# EAGLE design teste (EAGLE 7.6.0)
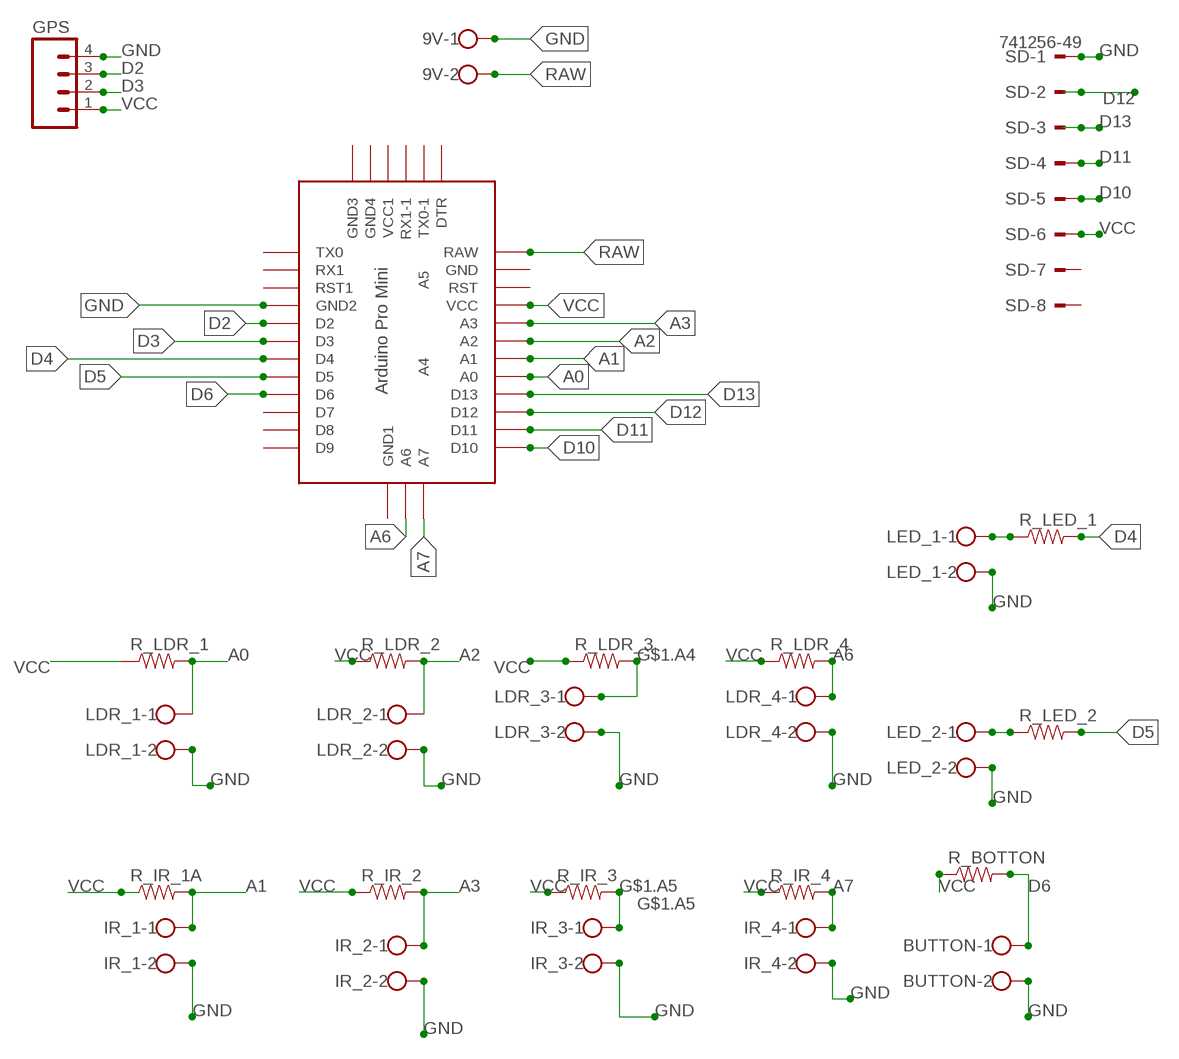
[diagram p0: schematic, sheet 1]

## Parts
9V  W237-102  [W237-102]
BUTTON  W237-102  [W237-102]
GPS  M04LONGPADS  [1X04_LONGPADS]
IR_1  W237-102  [W237-102]
IR_2  W237-102  [W237-102]
IR_3  W237-102  [W237-102]
IR_4  W237-102  [W237-102]
LDR_1  W237-102  [W237-102]
LDR_2  W237-102  [W237-102]
LDR_3  W237-102  [W237-102]
LDR_4  W237-102  [W237-102]
LED_1  W237-102  [W237-102]
LED_2  W237-102  [W237-102]
R_BOTTON  RESISTORAXIAL-0.3  [AXIAL-0.3]
R_IR_1A  RESISTORAXIAL-0.3  [AXIAL-0.3]
R_IR_2  RESISTORAXIAL-0.3  [AXIAL-0.3]
R_IR_3  RESISTORAXIAL-0.3  [AXIAL-0.3]
R_IR_4  RESISTORAXIAL-0.3  [AXIAL-0.3]
R_LDR_1  RESISTORAXIAL-0.3  [AXIAL-0.3]
R_LDR_2  RESISTORAXIAL-0.3  [AXIAL-0.3]
R_LDR_3  RESISTORAXIAL-0.3  [AXIAL-0.3]
R_LDR_4  RESISTORAXIAL-0.3  [AXIAL-0.3]
R_LED_1  RESISTORAXIAL-0.3  [AXIAL-0.3]
R_LED_2  RESISTORAXIAL-0.3  [AXIAL-0.3]
SD  741256-49  [741256-49]
U$2  ABK-PRO-MINI  [ABK-PRO-MINI]

## Nets
A0: LDR_1.1 R_LDR_1.P$2 U$2.A0
A1: IR_1.1 R_IR_1A.P$2 U$2.A1
A2: LDR_2.1 R_LDR_2.P$2 U$2.A2
A3: IR_2.1 R_IR_2.P$2 U$2.A3
A6: LDR_4.1 R_LDR_4.P$2 U$2.A6
A7: IR_4.1 R_IR_4.P$2 U$2.A7
D2: GPS.3 U$2.D2
D3: GPS.2 U$2.D3
D4: R_LED_1.P$2 U$2.D4
D5: R_LED_2.P$2 U$2.D5
D6: BUTTON.1 R_BOTTON.P$2 U$2.D6
D10: SD.5 U$2.D10
D11: SD.4 U$2.D11
D12: SD.2 U$2.D12
D13: SD.3 U$2.D13
G$1.A4: LDR_3.1 R_LDR_3.P$2
G$1.A5: IR_3.1 R_IR_3.P$2
GND: 9V.1 BUTTON.2 GPS.4 IR_1.2 IR_2.2 IR_3.2 IR_4.2 LDR_1.2 LDR_2.2 LDR_3.2 LDR_4.2 LED_1.2 LED_2.2 SD.1 U$2.GND1(GND2)
N$5: LED_1.1 R_LED_1.P$1
N$14: LED_2.1 R_LED_2.P$1
RAW: 9V.2 U$2.RAW
VCC: GPS.1 R_BOTTON.P$1 R_IR_1A.P$1 R_IR_2.P$1 R_IR_3.P$1 R_IR_4.P$1 R_LDR_1.P$1 R_LDR_2.P$1 R_LDR_3.P$1 R_LDR_4.P$1 SD.6 U$2.VCC
Unconnected: SD.7 SD.8 U$2.A4 U$2.A5 U$2.D7 U$2.D8 U$2.D9 U$2.DTR U$2.GND U$2.GND2(GND3) U$2.GND3(GND4) U$2.GND4(GND1) U$2.RST U$2.RST1 U$2.RX1 U$2.RX1-1 U$2.TX0 U$2.TX0-1 U$2.VCC1

## Library data of the parts
9V BUTTON IR_1-IR_4 LDR_1-LDR_4 LED_1 LED_2 = con-wago-500:W237-102: WAGO SCREW CLAMP; MPN: 237-102; OC_FARNELL: unknown; OC_NEWARK: 70K9898
GPS = SparkFun-Connectors:M04: Header 4 Standard 4-pin 0.1" header. Use with straight break away headers (SKU : PRT-00116), right angle break away headers (PRT-00553), swiss pins (PRT-00743), machine pins (PRT-00117), and female headers (PRT-00115). Molex polarized connector foot print use with SKU : PRT-08231 with associated crimp pins and housings. 1MM SMD Version SKU: PRT-10208; PROD_ID: CONN-09696
R_BOTTON R_IR_1A R_IR_2-R_IR_4 R_LDR_1-R_LDR_4 R_LED_1 R_LED_2 = SparkFun-Resistors:RESISTOR: Resistor Basic schematic elements and footprints for 0603, 1206, and PTH resistors.
SD = con-conrad:741256-49: Connector with Kabel
U$2 = arduino:ABK-PRO-MINI: ABK Pro-Mini Arduino Clone

## Net classes
0 default: width 0.406 mm

## Board
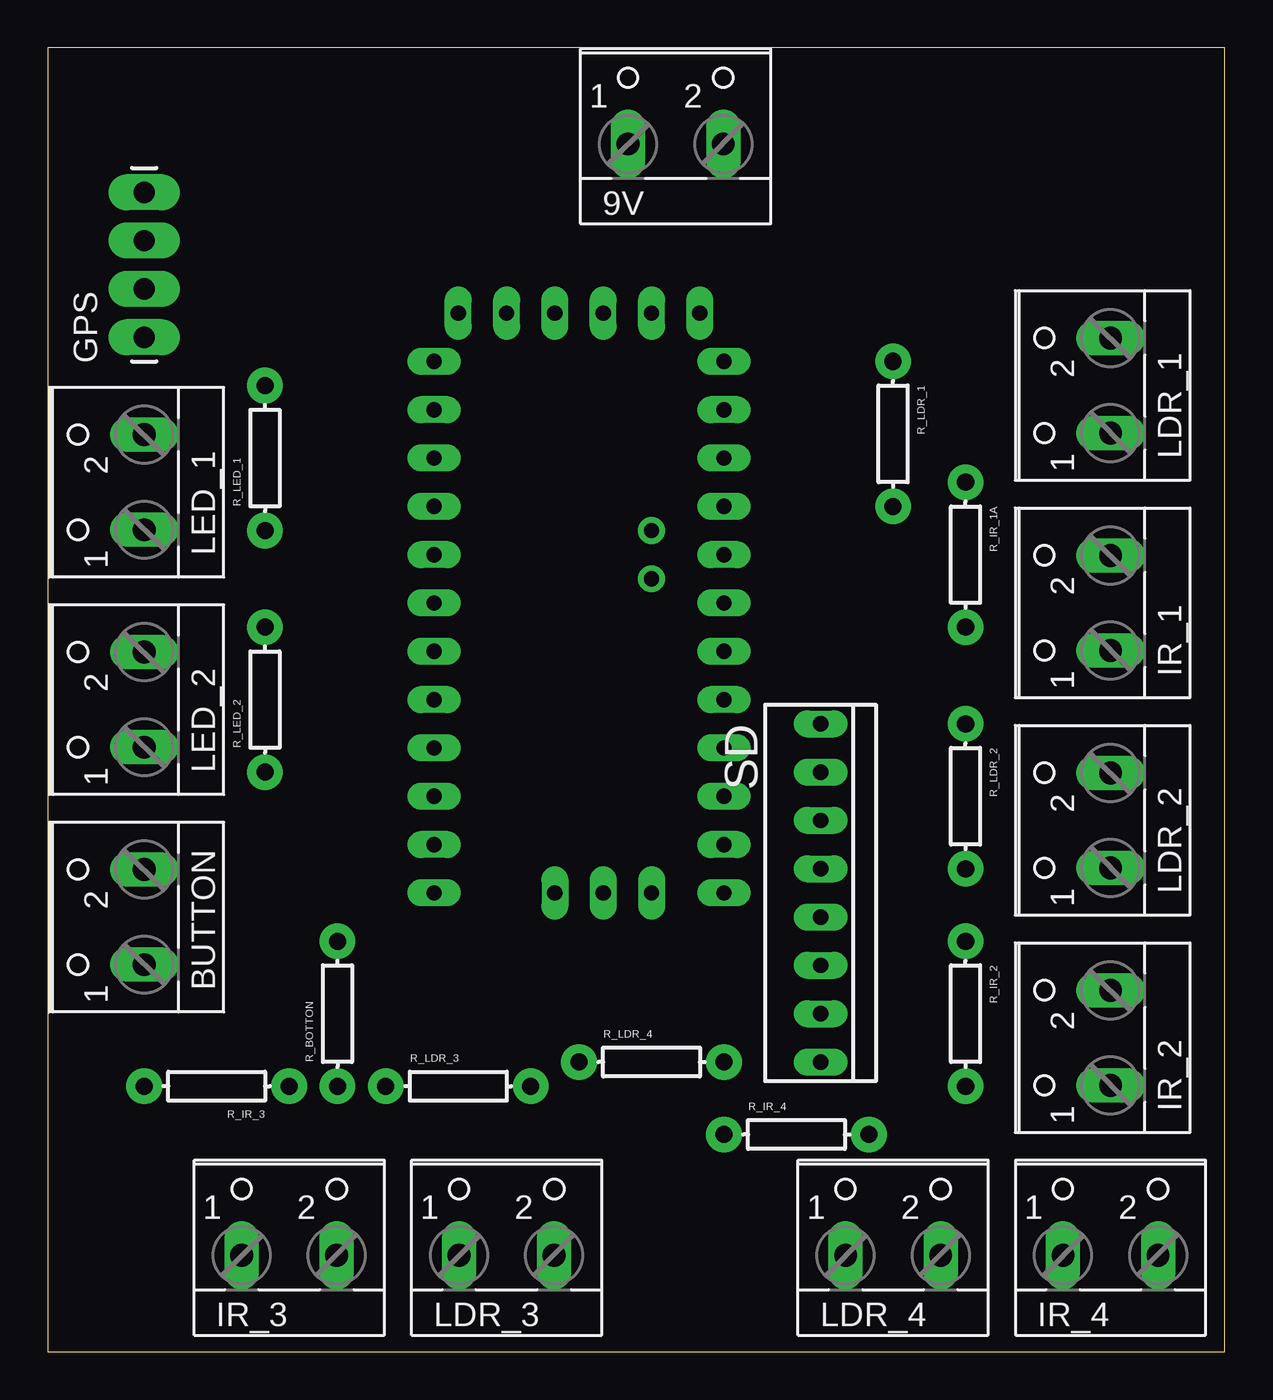
[diagram p1: board, top side]
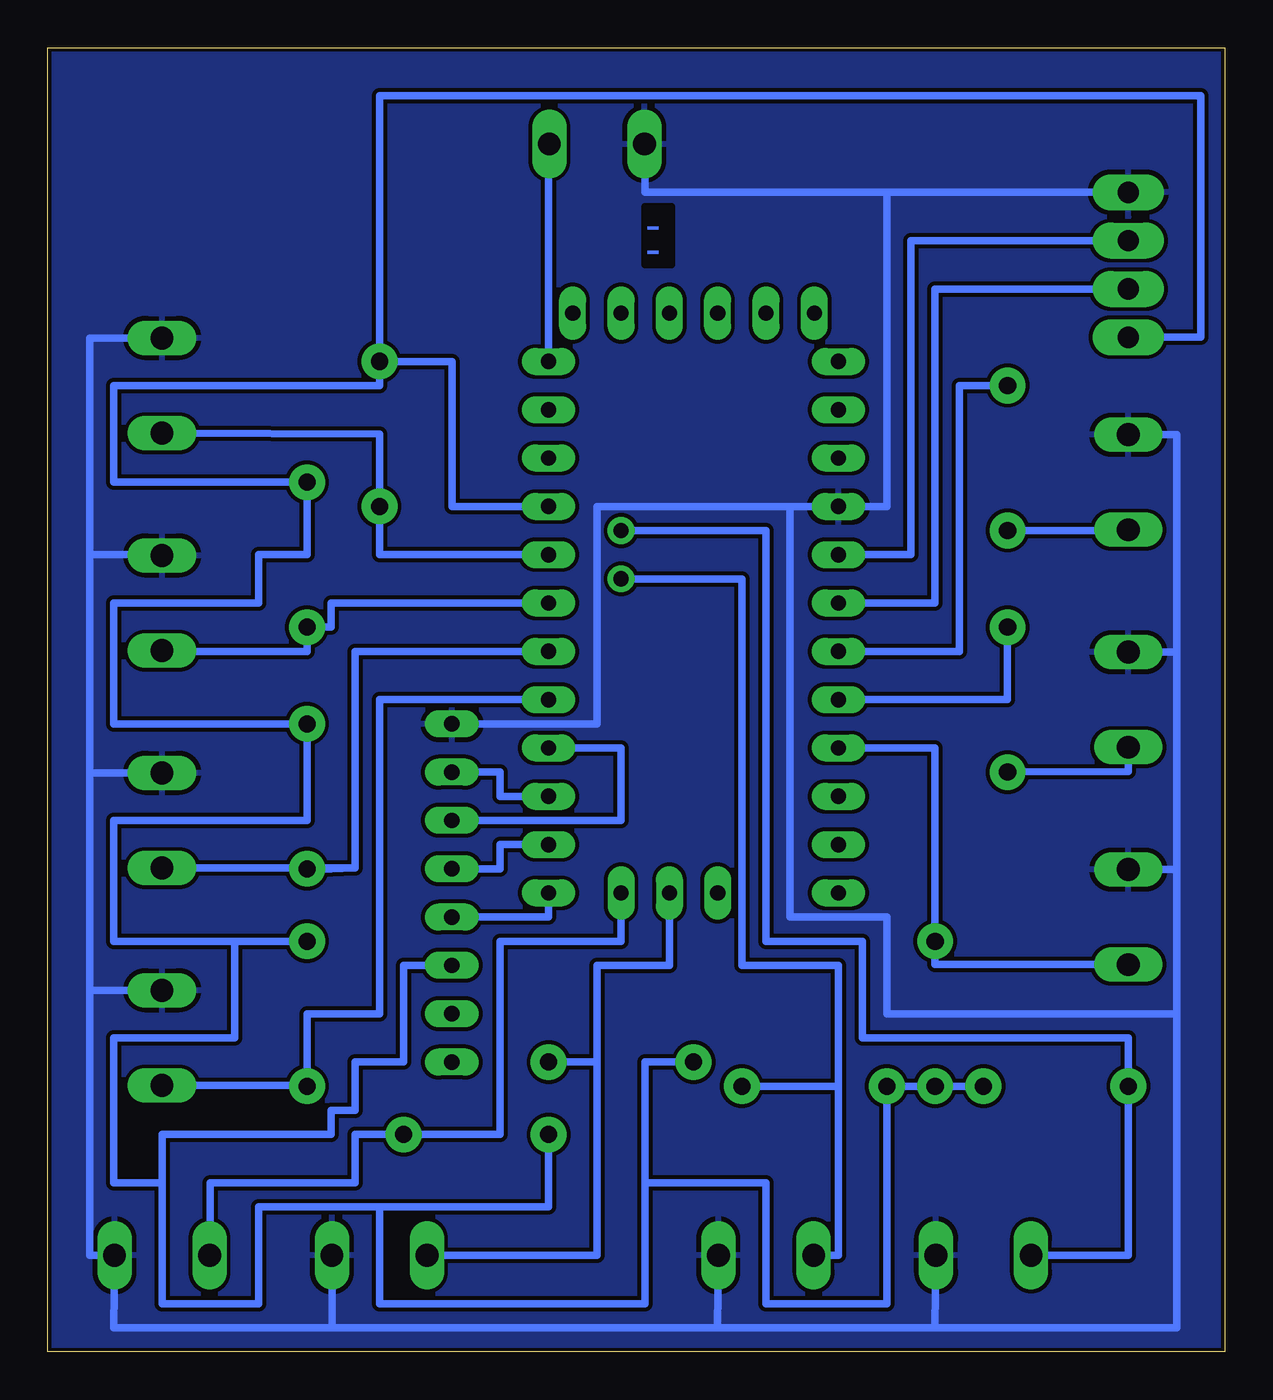
[diagram p2: board, bottom side, seen from below]

Size 61.9 x 68.57 mm. Coordinates in mm from the lower left corner, seen from the top.
Outline: 0,0 61.9,0 61.9,68.57 0,68.57 0,0
Copper layers (1*16): Top 0.035mm / dielectric 1.5mm / Bottom 0.035mm
Design rules "SparkFun": minimum track width 8mil, minimum drill 20mil, track to track 8mil, track to pad 8mil, pad to pad 8mil, via to via 8mil, smd to smd 8mil, copper to edge 8mil, drill to drill 8mil, minimum pad ring 12mil, minimum via ring 10mil, stop-mask expansion 4mil, vias tented up to drill 20mil, thermal gap 10mil

### Footprints (pad centres in the part's own frame; a part is rotated, then mirrored left to right if it is on the bottom)
W237-102 = drill 1.194 long: 1 -2.5,-1.27; 2 2.5,-1.27
1X04_LONGPADS = drill 1.118 pad 1.88 long: 1 0,0; 2 2.54,0; 3 5.08,0; 4 7.62,0
AXIAL-0.3 = drill 0.9 pad 1.88: P$1 -3.81,0; P$2 3.81,0
741256-49 = drill 0.813 pad 1.27 long: 1 -8.89,0; 2 -6.35,0; 3 -3.81,0; 4 -1.27,0; 5 1.27,0; 6 3.81,0; 7 6.35,0; 8 8.89,0
ABK-PRO-MINI = drill 0.8 long: A0 10.16,-3.81; A1 10.16,-6.35; A2 10.16,-8.89; A3 10.16,-11.43; A6 3.81,-21.59; A7 6.35,-21.59; D2 -5.08,-3.81; D3 -5.08,-6.35; D4 -5.08,-8.89; D5 -5.08,-11.43; D6 -5.08,-13.97; D7 -5.08,-16.51; D8 -5.08,-19.05; D9 -5.08,-21.59; D10 10.16,-21.59; D11 10.16,-19.05; D12 10.16,-16.51; D13 10.16,-13.97; DTR 8.89,8.89; GND 10.16,3.81; GND1 -5.08,-1.27; GND2 -3.81,8.89; GND3 -1.27,8.89; GND4 1.27,-21.59; RAW 10.16,6.35; RST 10.16,1.27; RST1 -5.08,1.27; RX1 -5.08,3.81; RX1-1 3.81,8.89; TX0 -5.08,6.35; TX0-1 6.35,8.89; VCC 10.16,-1.27; VCC1 1.27,8.89 | drill 0.8: A4 6.35,-5.08; A5 6.35,-2.54

### Placement (x,y rotation side)
9V  33.02,64.77 0 top
BUTTON  3.81,22.86 90 top
GPS  5.08,53.34 90 top
IR_1  54.61,39.37 90 top
IR_2  54.61,16.51 90 top
IR_3  12.7,6.35 0 top
IR_4  55.88,6.35 0 top
LDR_1  54.61,50.8 90 top
LDR_2  54.61,27.94 90 top
LDR_3  24.13,6.35 0 top
LDR_4  44.45,6.35 0 top
LED_1  3.81,45.72 90 top
LED_2  3.81,34.29 90 top
R_BOTTON  15.24,17.78 90 top
R_IR_1A  48.26,41.91 270 top
R_IR_2  48.26,17.78 270 top
R_IR_3  8.89,13.97 180 top
R_IR_4  39.37,11.43 0 top
R_LDR_1  44.45,48.26 270 top
R_LDR_2  48.26,29.21 270 top
R_LDR_3  21.59,13.97 0 top
R_LDR_4  31.75,15.24 0 top
R_LED_1  11.43,46.99 90 top
R_LED_2  11.43,34.29 90 top
SD  40.64,24.13 270 top
U$2  25.4,45.72 0 top

### Tracks (layer width: path | path; a pad name or v marks a point on that pad's centre or on a via)
A0
  Bottom 0.406: LDR_1.1 44.45,48.26 R_LDR_1.P$2 44.45,41.91 U$2.A0
A1
  Bottom 0.406: U$2.A1 46.99,39.37 46.99,38.1 R_IR_1A.P$2 48.26,36.83 55.88,36.83 IR_1.1
A2
  Bottom 0.406: U$2.A2 45.72,36.83 45.72,25.44 | 45.72,25.44 46.99,25.4 R_LDR_2.P$2 45.72,25.44 | LDR_2.1 45.72,25.44
A3
  Bottom 0.406: IR_2.1 48.26,14.01 R_IR_2.P$2 48.26,17.78 44.45,17.78 44.45,34.29 U$2.A3
A6
  Bottom 0.406: LDR_4.1 33.02,5.08 33.02,15.24 | R_LDR_4.P$2 33.02,15.24 | U$2.A6 29.21,20.32 33.02,20.32 33.02,15.24
A7
  Bottom 0.406: IR_4.1 53.34,5.08 53.34,8.89 45.72,8.89 45.72,11.43 R_IR_4.P$2 38.1,11.43 38.1,21.59 31.75,21.59 U$2.A7
D2
  Bottom 0.406: U$2.D2 16.51,41.91 16.51,58.42 GPS.3
D3
  Bottom 0.406: U$2.D3 15.24,39.37 15.24,55.88 GPS.2
D4
  Bottom 0.406: U$2.D4 13.97,36.83 13.97,50.8 R_LED_1.P$2
D5
  Bottom 0.406: R_LED_2.P$2 11.43,34.29 U$2.D5
D6
  Bottom 0.406: BUTTON.1 15.24,20.36 R_BOTTON.P$2 15.24,31.75 U$2.D6
D10
  Bottom 0.406: U$2.D10 35.56,22.86 SD.5
D11
  Bottom 0.406: SD.4 38.1,25.4 38.1,26.67 U$2.D11
D12
  Bottom 0.406: U$2.D12 38.1,29.21 38.1,30.48 SD.2
D13
  Bottom 0.406: U$2.D13 31.75,31.75 31.75,27.94 SD.3
G$1.A4
  Bottom 0.406: LDR_3.1 20.32,5.08 20.32,13.97 | 31.75,40.64 30.48,40.64 27.94,40.64 25.4,40.64 25.4,20.32 20.32,20.32 20.32,13.97 | 20.32,13.97 R_LDR_3.P$2
G$1.A5
  Bottom 0.406: IR_3.1 5.08,5.08 R_IR_3.P$2 5.08,16.51 19.05,16.51 19.05,21.59 24.13,21.59 24.13,43.18 29.21,43.18 30.48,43.18 31.75,43.18
GND
  Bottom 0.406: LDR_1.2 59.69,53.3 59.69,41.91 | 59.69,41.91 55.88,41.91 IR_1.2 | LDR_2.2 59.69,30.44 | 59.69,30.44 59.69,41.91 | 59.69,19.01 59.69,30.44 | IR_2.2 59.69,19.01 | 59.69,19.01 59.69,5.08 IR_4.2 58.42,1.27 46.95,1.27 | 46.95,1.27 LDR_4.2 | 30.52,64.77 9V.1 30.48,60.96 17.78,60.96 | LDR_3.2 26.67,1.27 | 26.67,1.27 46.95,1.27 | 15.24,1.27 2.54,1.27 2.54,17.78 | 15.24,1.27 26.67,1.27 | BUTTON.2 2.54,25.36 | 2.54,25.36 2.54,17.78 | LED_2.2 2.54,36.79 | 2.54,36.79 2.54,25.36 | LED_1.2 2.54,48.22 2.54,36.79 | 22.86,44.45 U$2.GND1 17.78,44.45 17.78,60.96 | 22.86,44.45 22.86,22.86 17.78,22.86 17.78,17.78 2.54,17.78 | GPS.4 17.78,60.96 | 22.86,44.45 33.02,44.45 33.02,33.02 SD.1 | IR_3.2 15.24,1.27
  pour Bottom: 0,68.58 62.23,68.58 62.23,0 0,0
N$5
  Bottom 0.406: R_LED_1.P$1 5.08,43.18 LED_1.1
N$14
  Bottom 0.406: LED_2.1 5.08,30.52 R_LED_2.P$1
RAW
  Bottom 0.406: 9V.2 35.56,64.77 U$2.RAW
VCC
  Bottom 0.406: R_LDR_1.P$1 44.45,50.8 58.42,50.8 58.42,45.72 R_IR_1A.P$1 48.26,41.91 50.8,41.91 50.8,39.37 58.42,39.37 58.42,33.02 R_LDR_2.P$1 48.26,27.94 58.42,27.94 58.42,21.59 52.07,21.59 | R_LDR_1.P$1 44.45,66.04 1.27,66.04 1.27,53.34 GPS.1 | R_IR_2.P$1 52.07,21.59 | 52.07,21.59 52.07,16.51 58.42,16.51 58.42,8.89 55.88,8.89 | 55.88,8.89 55.88,2.54 50.8,2.54 50.8,7.62 44.45,7.62 | 44.45,7.62 44.45,2.54 30.48,2.54 30.48,8.89 | 30.48,8.89 24.13,8.89 24.13,2.54 17.78,2.54 R_LDR_3.P$1 | R_IR_4.P$1 35.56,7.62 44.45,7.62 | SD.6 43.18,20.32 43.18,15.24 45.72,15.24 45.72,12.7 46.99,12.7 46.99,11.43 55.88,11.43 55.88,8.89 | R_IR_3.P$1 R_LDR_3.P$1 | R_BOTTON.P$1 R_LDR_3.P$1 | R_LDR_4.P$1 30.48,15.24 30.48,8.89 | U$2.VCC 40.64,44.45 40.64,52.07 R_LDR_1.P$1

### Text on the board
Bottom: - | - | - | - | - | -